# EAGLE design micromouse (EAGLE 9.6.2)
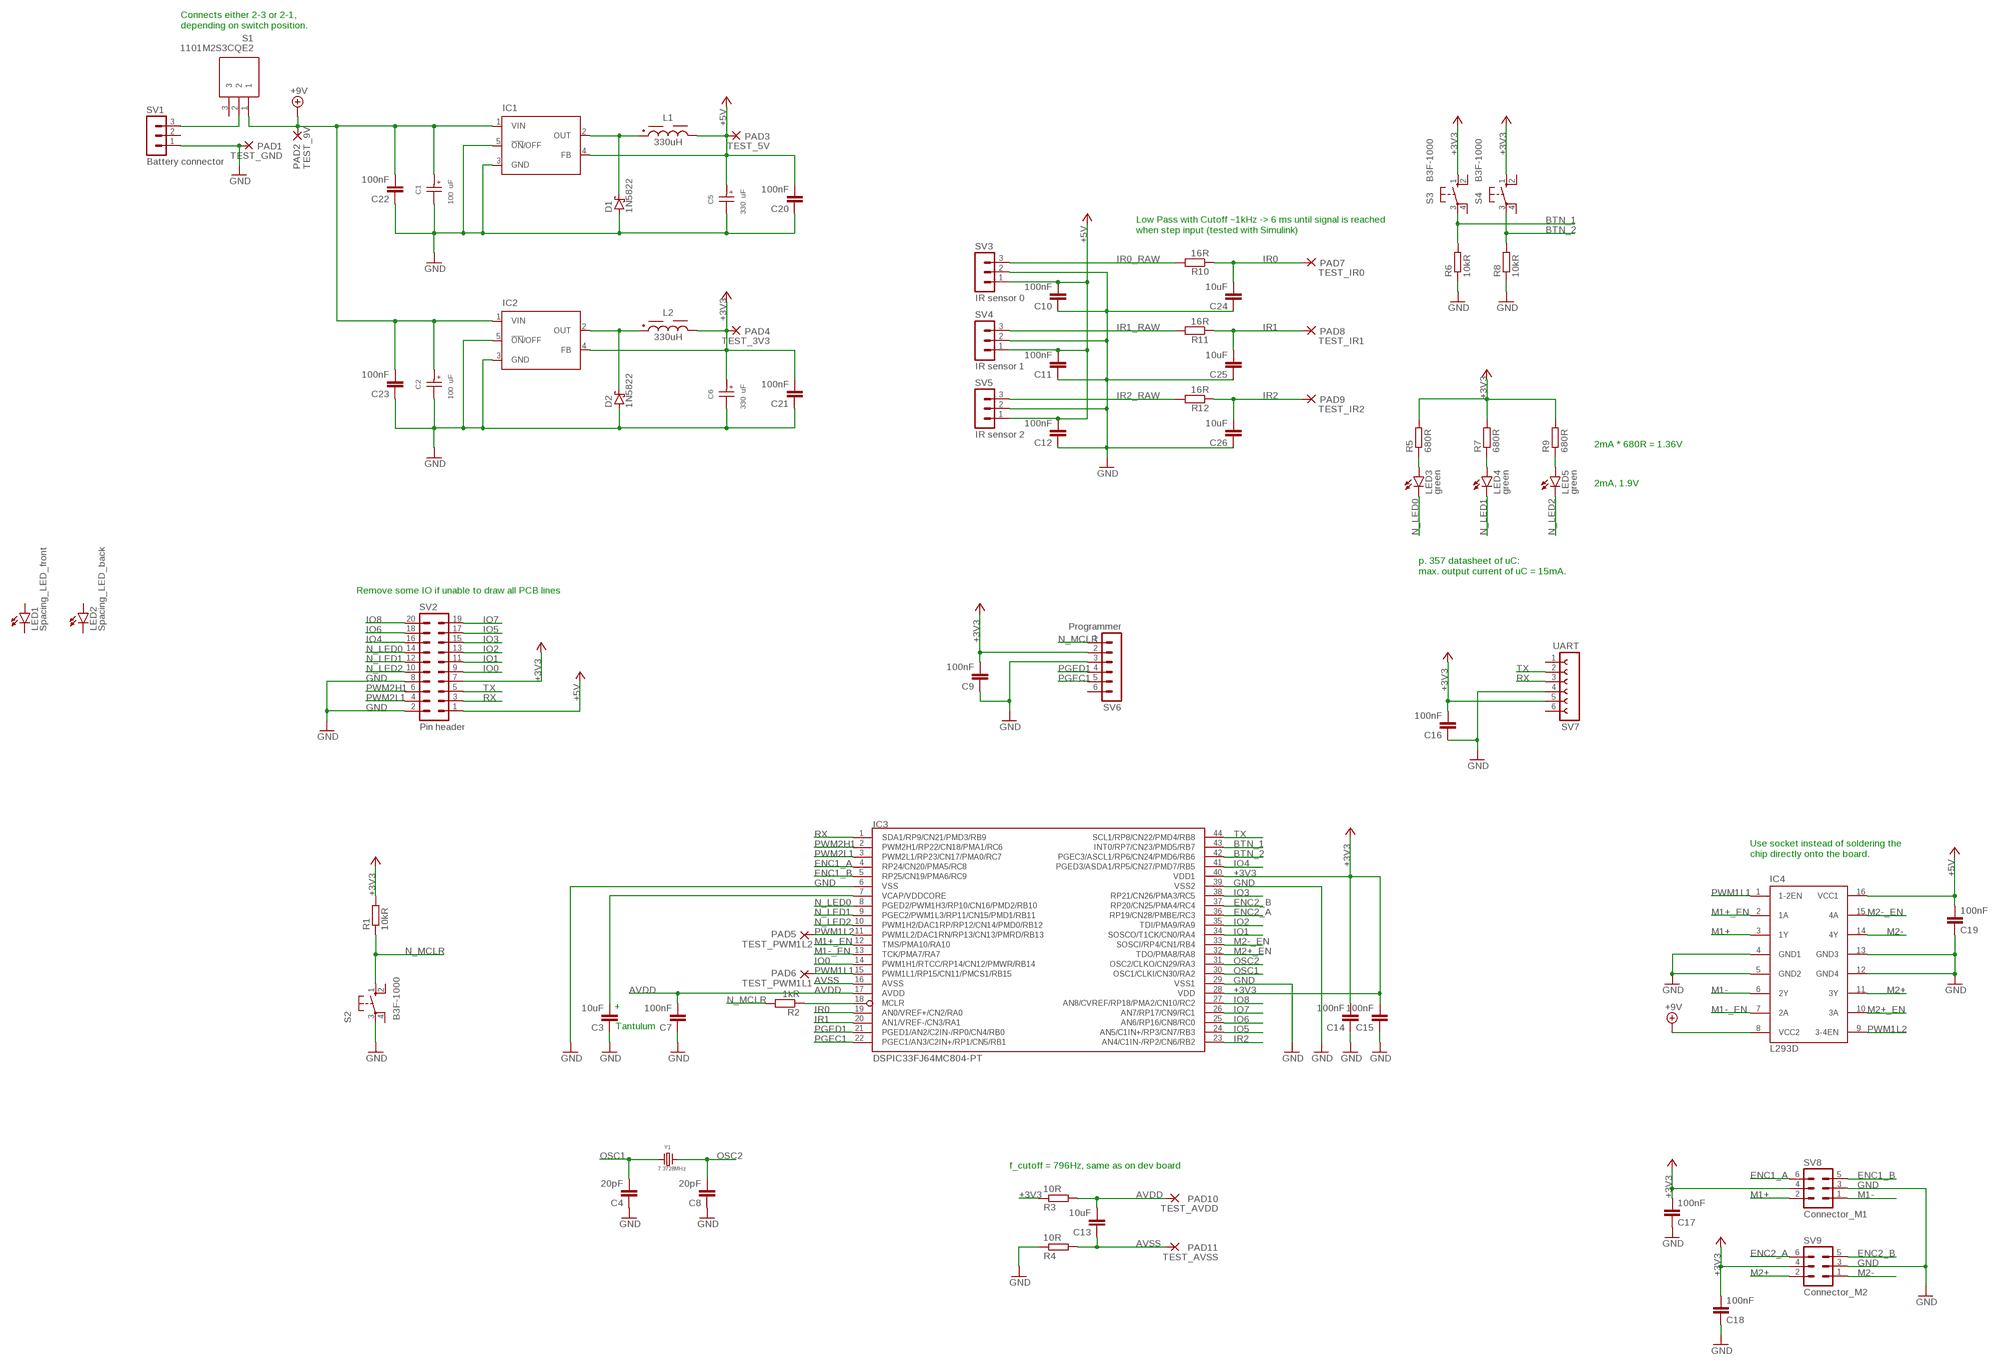
[diagram p0: schematic, sheet 1]

## Parts
C1  100 uF  WCAP-ATG5_5X11_860020272005  [WCAP-ATG5_5X11(DXL)]
C2  100 uF  WCAP-ATG5_5X11_860020272005  [WCAP-ATG5_5X11(DXL)]
C3  10uF  C-EUC0805  [C0805]
C4  20pF  C-EUC0805  [C0805]
C5  330 uF  WCAP-ATG5_6.3X11_860020273010  [WCAP-ATG5_6.3X11(DXL)]
C6  330 uF  WCAP-ATG5_6.3X11_860020273010  [WCAP-ATG5_6.3X11(DXL)]
C7  100nF  C-EUC0805  [C0805]
C8  20pF  C-EUC0805  [C0805]
C9  100nF  C-EUC0805  [C0805]
C10  100nF  C-EUC0805  [C0805]
C11  100nF  C-EUC0805  [C0805]
C12  100nF  C-EUC0805  [C0805]
C13  10uF  C-EUC0805  [C0805]
C14  100nF  C-EUC0805  [C0805]
C15  100nF  C-EUC0805  [C0805]
C16  100nF  C-EUC0805  [C0805]
C17  100nF  C-EUC0805  [C0805]
C18  100nF  C-EUC0805  [C0805]
C19  100nF  C-EUC0805  [C0805]
C20  100nF  C-EUC0805  [C0805]
C21  100nF  C-EUC0805  [C0805]
C22  100nF  C-EUC0805  [C0805]
C23  100nF  C-EUC0805  [C0805]
C24  10uF  C-EUC0805  [C0805]
C25  10uF  C-EUC0805  [C0805]
C26  10uF  C-EUC0805  [C0805]
D1  1N5822  BAT19  [DO35-10]
D2  1N5822  BAT19  [DO35-10]
IC1  LM2575-5.0WU-(TR)  LM2596S  [TO263-5]
IC2  LM2575-3.3WU-(TR)  LM2596S  [TO263-5]
IC3  DSPIC33FJ64MC804-PT  [TQFP44]
IC4  L293D  [DIL16]
L1  330uH  WE-TIS_1111_7447471331  [WE-TIS_1111]
L2  330uH  WE-TIS_1111_7447471331  [WE-TIS_1111]
LED1  Spacing_LED_front  LED5MM  [LED5MM]
LED2  Spacing_LED_back  LED5MM  [LED5MM]
LED3  green  LEDCHIP-LED0805  [CHIP-LED0805]
LED4  green  LEDCHIP-LED0805  [CHIP-LED0805]
LED5  green  LEDCHIP-LED0805  [CHIP-LED0805]
PAD1  TEST_GND  3,17/1,3  [3,17/1,3]
PAD2  TEST_9V  3,17/1,3  [3,17/1,3]
PAD3  TEST_5V  3,17/1,3  [3,17/1,3]
PAD4  TEST_3V3  3,17/1,3  [3,17/1,3]
PAD5  TEST_PWM1L2  3,17/1,3  [3,17/1,3]
PAD6  TEST_PWM1L1  3,17/1,3  [3,17/1,3]
PAD7  TEST_IR0  3,17/1,3  [3,17/1,3]
PAD8  TEST_IR1  3,17/1,3  [3,17/1,3]
PAD9  TEST_IR2  3,17/1,3  [3,17/1,3]
PAD10  TEST_AVDD  3,17/1,3  [3,17/1,3]
PAD11  TEST_AVSS  3,17/1,3  [3,17/1,3]
R1  10kR  R-EU_R0805  [R0805]
R2  1kR  R-EU_R0805  [R0805]
R3  10R  R-EU_R0805  [R0805]
R4  10R  R-EU_R0805  [R0805]
R5  680R  R-EU_R0805  [R0805]
R6  10kR  R-EU_R0805  [R0805]
R7  680R  R-EU_R0805  [R0805]
R8  10kR  R-EU_R0805  [R0805]
R9  680R  R-EU_R0805  [R0805]
R10  16R  R-EU_R0805  [R0805]
R11  16R  R-EU_R0805  [R0805]
R12  16R  R-EU_R0805  [R0805]
S1  1101M2S3CQE2  [1000-SERIES(SPDT)]
S2  B3F-1000  10-XX  [B3F-10XX]
S3  B3F-1000  10-XX  [B3F-10XX]
S4  B3F-1000  10-XX  [B3F-10XX]
SV1  Battery connector  MA03-1  [MA03-1]
SV2  Pin header  MA10-2  [MA10-2]
SV3  IR sensor 0  MA03-1  [MA03-1]
SV4  IR sensor 1  MA03-1  [MA03-1]
SV5  IR sensor 2  MA03-1  [MA03-1]
SV6  Programmer  MA06-1  [MA06-1]
SV7  UART  FE06-1  [FE06]
SV8  Connector_M1  ML6  [ML6]
SV9  Connector_M2  ML6  [ML6]
Y1  7.3728MHz  WE-XTAL_HC49/4H_830003335B  [WE-XTAL_HC49/4H]

## Nets
+3V3: C6.1(+) C9.2 C14.2 C15.2 C16.2 C17.2 C18.2 C21.2 IC2.4(FB) IC3.28(VDD) IC3.40(VDD1) L2.2 PAD4.1(P) R1.2 R3.1 R5.2 R7.2 R9.2 S3.1(S) S4.1(S) SV2.7 SV6.2 SV7.5 SV8.4 SV9.4
+5V: C5.1(+) C10.2 C11.2 C12.2 C19.2 C20.2 IC1.4(FB) IC4.16(VCC1) L1.2 PAD3.1(P) SV2.1 SV3.1 SV4.1 SV5.1
+9V: C1.1(+) C2.1(+) C22.2 C23.2 IC1.1(VIN) IC2.1(VIN) IC4.8(VCC2) PAD2.1(P) S1.1
AVDD: C7.2 C13.2 IC3.17(AVDD) PAD10.1(P) R3.2
AVSS: C13.1 IC3.16(AVSS) PAD11.1(P) R4.2
BTN_1: IC3.43(INT0/RP7/CN23/PMD5/RB7) R6.2 S3.3(P)
BTN_2: IC3.42(PGEC3/ASCL1/RP6/CN24/PMD6/RB6) R8.2 S4.3(P)
ENC1_A: IC3.4(RP24/CN20/PMA5/RC8) SV8.6
ENC1_B: IC3.5(RP25/CN19/PMA6/RC9) SV8.5
ENC2_A: IC3.36(RP19/CN28/PMBE/RC3) SV9.6
ENC2_B: IC3.37(RP20/CN25/PMA4/RC4) SV9.5
GND: C1.2(-) C2.2(-) C3.1 C4.1 C5.2(-) C6.2(-) C7.1 C8.1 C9.1 C10.1 C11.1 C12.1 C14.1 C15.1 C16.1 C17.1 C18.1 C19.1 C20.1 C21.1 C22.1 C23.1 C24.1 C25.1 C26.1 D1.A D2.A IC1.3(GND) IC1.5(!ON!/OFF) IC2.3(GND) IC2.5(!ON!/OFF) IC3.6(VSS) IC3.29(VSS1) IC3.39(VSS2) IC4.4(GND1) IC4.5(GND2) IC4.12(GND4) IC4.13(GND3) PAD1.1(P) R4.1 R6.1 R8.1 S2.3(P) SV1.1 SV2.2 SV2.8 SV3.2 SV4.2 SV5.2 SV6.3 SV7.4 SV8.3 SV9.3
IO0: IC3.14(PWM1H1/RTCC/RP14/CN12/PMWR/RB14) SV2.9
IO1: IC3.34(SOSCO/T1CK/CN0/RA4) SV2.11
IO2: IC3.35(TDI/PMA9/RA9) SV2.13
IO3: IC3.38(RP21/CN26/PMA3/RC5) SV2.15
IO4: IC3.41(PGED3/ASDA1/RP5/CN27/PMD7/RB5) SV2.16
IO5: IC3.24(AN5/C1IN+/RP3/CN7/RB3) SV2.17
IO6: IC3.25(AN6/RP16/CN8/RC0) SV2.18
IO7: IC3.26(AN7/RP17/CN9/RC1) SV2.19
IO8: IC3.27(AN8/CVREF/RP18/PMA2/CN10/RC2) SV2.20
IR0: C24.2 IC3.19(AN0/VREF+/CN2/RA0) PAD7.1(P) R10.1
IR0_RAW: R10.2 SV3.3
IR1: C25.2 IC3.20(AN1/VREF-/CN3/RA1) PAD8.1(P) R11.1
IR1_RAW: R11.2 SV4.3
IR2: C26.2 IC3.23(AN4/C1IN-/RP2/CN6/RB2) PAD9.1(P) R12.1
IR2_RAW: R12.2 SV5.3
M1+: IC4.3(1Y) SV8.2
M1+_EN: IC3.12(TMS/PMA10/RA10) IC4.2(1A)
M1-: IC4.6(2Y) SV8.1
M1-_EN: IC3.13(TCK/PMA7/RA7) IC4.7(2A)
M2+: IC4.11(3Y) SV9.2
M2+_EN: IC3.32(TDO/PMA8/RA8) IC4.10(3A)
M2-: IC4.14(4Y) SV9.1
M2-_EN: IC3.33(SOSCI/RP4/CN1/RB4) IC4.15(4A)
N$1: IC3.18(MCLR) R2.1
N$2: S1.2 SV1.3
N$4: LED3.A R5.1
N$5: LED4.A R7.1
N$6: LED5.A R9.1
N$7: D1.C IC1.2(OUT) L1.1
N$8: D2.C IC2.2(OUT) L2.1
N_LED0: IC3.8(PGED2/PWM1H3/RP10/CN16/PMD2/RB10) LED3.C SV2.14
N_LED1: IC3.9(PGEC2/PWM1L3/RP11/CN15/PMD1/RB11) LED4.C SV2.12
N_LED2: IC3.10(PWM1H2/DAC1RP/RP12/CN14/PMD0/RB12) LED5.C SV2.10
N_MCLR: R1.1 R2.2 S2.1(S) SV6.1
OSC1: C4.2 IC3.30(OSC1/CLKI/CN30/RA2) Y1.1
OSC2: C8.2 IC3.31(OSC2/CLKO/CN29/RA3) Y1.2
PGEC1: IC3.22(PGEC1/AN3/C2IN+/RP1/CN5/RB1) SV6.5
PGED1: IC3.21(PGED1/AN2/C2IN-/RP0/CN4/RB0) SV6.4
PWM1L1: IC3.15(PWM1L1/RP15/CN11/PMCS1/RB15) IC4.1(1-2EN) PAD6.1(P)
PWM1L2: IC3.11(PWM1L2/DAC1RN/RP13/CN13/PMRD/RB13) IC4.9(3-4EN) PAD5.1(P)
PWM2H1: IC3.2(PWM2H1/RP22/CN18/PMA1/RC6) SV2.6
PWM2L1: IC3.3(PWM2L1/RP23/CN17/PMA0/RC7) SV2.4
RX: IC3.1(SDA1/RP9/CN21/PMD3/RB9) SV2.3 SV7.3
TX: IC3.44(SCL1/RP8/CN22/PMD4/RB8) SV2.5 SV7.2
VCAP/VDDCORE: C3.2 IC3.7(VCAP/VDDCORE)
Unconnected: LED1.A LED1.K(C) LED2.A LED2.K(C) S1.3 S2.2(S1) S2.4(P1) S3.2(S1) S3.4(P1) S4.2(S1) S4.4(P1) SV1.2 SV6.6 SV7.1 SV7.6

## Notes on the sheet
- Connects either 2-3 or 2-1,
  depending on switch position.
- Low Pass with Cutoff ~1kHz -> 6 ms until signal is reached
  when step input (tested with Simulink)
- 2mA * 680R = 1.36V
- 2mA, 1.9V
- p. 357 datasheet of uC:
  max. output current of uC = 15mA.
- Remove some IO if unable to draw all PCB lines
- Use socket instead of soldering the
  chip directly onto the board.
- +
- Tantulum
- f_cutoff = 796Hz, same as on dev board

## Library data of the parts
C1 C2 = Eagle_WCAP-ATG5 (rev21a):WCAP-ATG5_5X11: WCAP-ATG5 Aluminium Electrolytic Capacitors General Purpose +105 °C Characteristics General purpose product series with max. operating temperature of +105 °C Mounting style: THT Radial Capacitance range: 0.1 µF ‒ 18000 µF Capacitance tolerance: ±20 % Operating temperature: -40 °C up to +105 °C for UR < 400 V(DC) -25 °C up to +105 °C for UR ≥ 400 V(DC) Endurance: 2000 h @ +105 °C Dimensions (DxL) in mm: 5.0 x 11.0 up to 22.0 x 31.0 Recommended soldering: Wave soldering Applications Filtering Smoothing Energy storage Coupling e.g. Switched-mode power supply, AC/DC converter, adapter, charger, digital camera <https://www.we-online.com/catalog/media/o35284v209%20WCAP-ATG5_4C.jpg> Details see: https://www.we-online.com/catalog/en/WCAP-ATG5/ Updated by yingchun,Shan;2020-02-28 2020(C) Würth Elektronik; DATASHEET-URL: https://www.we-online.com/catalog/datasheet/860020272005.pdf; DF: 17%; DIAMETER: 5mm; I-LEAK: 10uA; I-RIPPLE: 105mA; L: 11mm; OPERATING-TEMPERATURE: -40 °C up to +105 °C; PART-NUMBER: 860020272005; PITCH: 2mm; TECHNICAL-REFERENCE: ATDC110101M010DSPA3B000; VR: 10V(DC)
C3 C4 C7-C26 = rcl:C-EU: CAPACITOR, European symbol; SPICEPREFIX: C
C5 C6 = Eagle_WCAP-ATG5 (rev21a):WCAP-ATG5_6.3X11: WCAP-ATG5 Aluminium Electrolytic Capacitors General Purpose +105 °C Characteristics General purpose product series with max. operating temperature of +105 °C Mounting style: THT Radial Capacitance range: 0.1 µF ‒ 18000 µF Capacitance tolerance: ±20 % Operating temperature: -40 °C up to +105 °C for UR < 400 V(DC) -25 °C up to +105 °C for UR ≥ 400 V(DC) Endurance: 2000 h @ +105 °C Dimensions (DxL) in mm: 5.0 x 11.0 up to 22.0 x 31.0 Recommended soldering: Wave soldering Applications Filtering Smoothing Energy storage Coupling e.g. Switched-mode power supply, AC/DC converter, adapter, charger, digital camera <https://www.we-online.com/catalog/media/o35284v209%20WCAP-ATG5_4C.jpg> Details see: https://www.we-online.com/catalog/en/WCAP-ATG5/ Updated by yingchun,Shan;2020-02-28 2020(C) Würth Elektronik; DATASHEET-URL: https://www.we-online.com/catalog/datasheet/860020273010.pdf; DF: 17%; DIAMETER: 6.3mm; I-LEAK: 33uA; I-RIPPLE: 205mA; L: 11mm; OPERATING-TEMPERATURE: -40 °C up to +105 °C; PART-NUMBER: 860020273010; PITCH: 2.5mm; TECHNICAL-REFERENCE: ATDD110331M010DSPA4B000; VR: 10V(DC)
D1 D2 = diode:BAT19: DIODE barrier diode
IC1 IC2 = national-semiconductor:LM2596: SIMPLE SWITCHER® Power Converter 150 kHz 3A Step-Down Voltage Regulator Source: http://www.national.com/ds/LM/LM2596.pdf; MF: NATIONAL SEMICONDUCTOR; MPN: LM2596S-ADJ/NOPB; OC_FARNELL: 9494367; OC_NEWARK: 41K3842
IC3 = microchip-dspic33fjxxmc:DSPIC33FJ64MC804: dsPIC33FJ32MC302/304, dsPIC33FJ64MCX02/X04, AND dsPIC33FJ128MCX02/X04 High-Performance, 16-bit Digital Signal Controllers Package:44 Pin TQFP Operating Range: * Up to 40 MIPS operation (at 3.0V -3.6V): - Industrial temperature range (-40°C to +85°C) - Extended temperature range (-40°C to +125°C) High-Performance DSC CPU: * Modified Harvard architecture * C compiler optimized instruction set * 16-bit wide data path * 24-bit wide instructions * Linear program memory addressing up to 4M instruction words * Linear data memory addressing up to 64 Kbytes * 83 base instructions: mostly 1 word/1 cycle * Two 40-bit accumulators with rounding and saturation options * Flexible and powerful addressing modes: - Indirect - Modulo - Bit-Reversed * Software stack * 16 x 16 fractional/integer multiply operations * 32/16 and 16/16 divide operations * Single-cycle multiply and accumulate: - Accumulator write back for DSP operations - Dual data fetch * Up to ±16-bit shifts for up to 40-bit data Direct Memory Access (DMA): * 8-channel hardware DMA * Up to 2 Kbytes dual ported DMA buffer area (DMA RAM) to store data transferred via DMA: - Allows data transfer between RAM and a peripheral while CPU is executing code (no cycle stealing) * Most peripherals support DMA Timers/Capture/Compare/PWM: * Timer/Counters, up to five 16-bit timers: - Can pair up to make two 32-bit timers - One timer runs as a Real-Time Clock with an external 32.768 kHz oscillator - Programmable prescaler * Input Capture (up to four channels): - Capture on up, down or both edges - 16-bit capture input functions - 4-deep FIFO on each capture * Output Compare (up to four channels): - Single or Dual 16-bit Compare mode - 16-bit Glitchless PWM mode * Hardware Real-Time Clock/Calendar (RTCC): - Provides clock, calendar, and alarm functions Interrupt Controller: * 5-cycle latency * Up to 53 available interrupt sources * Up to three external interrupts * Seven programmable priority levels * Five processor exceptions Digital I/O: * Peripheral pin Select functionality * Up to 35 programmable digital I/O pins * Wake-up/Interrupt-on-Change for up to 31 pins * Output pins can drive from 3.0V to 3.6V * Up to 5V output with open drain configuration * All digital input pins are 5V tolerant * 4 mA sink on all I/O pins On-Chip Flash and SRAM: * Flash program memory (up to 128 Kbytes) * Data SRAM (up to 16 Kbytes) * Boot, Secure, and General Security for program Flash System Management: * Flexible clock options: - External, crystal, resonator, internal RC - Fully integrated Phase-Locked Loop (PLL) - Extremely low jitter PLL * Power-up Timer * Oscillator Start-up Timer/Stabilizer * Watchdog Timer with its own RC oscillator * Fail-Safe Clock Monitor * Reset by multiple sources Power Management: * On-chip 2.5V voltage regulator * Switch between clock sources in real time * Idle, Sleep, and Doze modes with fast wake-up Analog-to-Digital Converters (ADCs): * 10-bit, 1.1 Msps or 12-bit, 500 Ksps conversion: - Two and four simultaneous samples (10-bit ADC) - Up to nine input channels with auto-scanning - Conversion start can be manual or synchronized with one of four trigger sources - Conversion possible in Sleep mode - ±2 LSb max integral nonlinearity - ±1 LSb max differential nonlinearity Audio Digital-to-Analog Converter (DAC): - 16-bit Dual Channel DAC module - 100 Ksps maximum sampling rate - Second-Order Digital Delta-Sigma Modulator Comparator Module: * Two analog comparators with programmable input/output configuration CMOS Flash Technology: * Low-power, high-speed Flash technology * Fully static design * 3.3V (±10%) operating voltage * Industrial and Extended temperature * Low power consumption Motor Control Peripherals: * 6-channel 16-bit Motor Control PWM: - Three duty cycle generators - Independent or Complementary mode - Programmable dead-time and output polarity - Edge-aligned or center-aligned - Manual output override control - One Fault input - Trigger for ADC conversions - PWM frequency for 16-bit resolution (@ 40 MIPS) = 1220 Hz for Edge-Aligned mode, 610 Hz for Center-Aligned mode - PWM frequency for 11-bit resolution (@ 40 MIPS) = 39.1 kHz for Edge-Aligned mode, 19.55 kHz for Center-Aligned mode * 2-channel 16-bit Motor Control PWM: - One duty cycle generator - Independent or Complementary mode - Programmable dead time and output polarity - Edge-aligned or center-aligned - Manual output override control - One Fault input - Trigger for ADC conversions - PWM frequency for 16-bit resolution (@ 40 MIPS) = 1220 Hz for Edge-Aligned mode, 610 Hz for Center-Aligned mode - PWM frequency for 11-bit resolution (@ 40 MIPS) = 39.1 kHz for Edge-Aligned mode, 19.55 kHz for Center-Aligned mode * 2-Quadrature Encoder Interface module: - Phase A, Phase B, and index pulse input - 16-bit up/down position counter - Count direction status - Position Measurement (x2 and x4) mode - Programmable digital noise filters on inputs - Alternate 16-bit Timer/Counter mode - Interrupt on position counter rollover/underflow
IC4 = st-microelectronics:L293D: PUSH-PULL 4 CHANNEL DRIVER; MPN: L293D; OC_FARNELL: 9589619; OC_NEWARK: 56P8249
L1 L2 = Eagle_WE-TIS (rev22a):WE-TIS_1111: WE-TIS Radial Leaded Wire Wound Inductor Shielded Characteristics Radial through-hole inductor High saturation core material High current capacity Custom design on request Applications Signal filtering Switches, switching power supply for small and medium voltage Power supply filter EMI filter <https://www.we-online.com/catalog/media/o14867v209%20Family_WE-TIS.jpg> Details see: www.we-online.com/catalog/WE-TIS <www.we-online.com/catalog/WE-TIS/?utm_source=eagle_model&utm_medium=description_link&utm_campaign=eisos_eagle> Updated by Ella Wu, 2022-06-16 2022 (C) Wurth Elektronik; DATASHEET-URL: https://www.we-online.com/redexpert/spec/7447471331?ae; FRES: 2.1MHz; IR: 0.8A; ISAT: 1.1A; MOUNT: THT; PART-NUMBER: 7447471331; RDC-MAX: 810mohm; RDC-TYP: 670mohm
LED1-LED5 = led:LED: LED OSRAM: - CHIPLED LG R971, LG N971, LY N971, LG Q971, LY Q971, LO R971, LY R971 LH N974, LH R974 LS Q976, LO Q976, LY Q976 LO Q996 - Hyper CHIPLED LW Q18S LB Q993, LB Q99A, LB R99A - SideLED LS A670, LO A670, LY A670, LG A670, LP A670 LB A673, LV A673, LT A673, LW A673 LH A674 LY A675 LS A676, LA A676, LO A676, LY A676, LW A676 LS A679, LY A679, LG A679 - Hyper Micro SIDELED® LS Y876, LA Y876, LO Y876, LY Y876 LT Y87S - SmartLED LW L88C, LW L88S LB L89C, LB L89S, LG L890 LS L89K, LO L89K, LY L89K LS L896, LA L896, LO L896, LY L896 - TOPLED LS T670, LO T670, LY T670, LG T670, LP T670 LSG T670, LSP T670, LSY T670, LOP T670, LYG T670 LG T671, LOG T671, LSG T671 LB T673, LV T673, LT T673, LW T673 LH T674 LS T676, LA T676, LO T676, LY T676, LB T676, LH T676, LSB T676, LW T676 LB T67C, LV T67C, LT T67C, LS T67K, LO T67K, LY T67K, LW E67C LS E67B, LA E67B, LO E67B, LY E67B, LB E67C, LV E67C, LT E67C LW T67C LS T679, LY T679, LG T679 LS T770, LO T770, LY T770, LG T770, LP T770 LB T773, LV T773, LT T773, LW T773 LH T774 LS E675, LA E675, LY E675, LS T675 LS T776, LA T776, LO T776, LY T776, LB T776 LHGB T686 LT T68C, LB T68C - Hyper Mini TOPLED® LB M676 - Mini TOPLED Santana® LG M470 LS M47K, LO M47K, LY M47K Source: http://www.osram.convergy.de LUXEON: - LUMILED® LXK2-PW12-R00, LXK2-PW12-S00, LXK2-PW14-U00, LXK2-PW14-V00 LXK2-PM12-R00, LXK2-PM12-S00, LXK2-PM14-U00 LXK2-PE12-Q00, LXK2-PE12-R00, LXK2-PE12-S00, LXK2-PE14-T00, LXK2-PE14-U00 LXK2-PB12-K00, LXK2-PB12-L00, LXK2-PB12-M00, LXK2-PB14-N00, LXK2-PB14-P00, LXK2-PB14-Q00 LXK2-PR12-L00, LXK2-PR12-M00, LXK2-PR14-Q00, LXK2-PR14-R00 LXK2-PD12-Q00, LXK2-PD12-R00, LXK2-PD12-S00 LXK2-PH12-R00, LXK2-PH12-S00 LXK2-PL12-P00, LXK2-PL12-Q00, LXK2-PL12-R00 Source: www.luxeon.com KINGBRIGHT: KA-3528ASYC Source: www.kingbright.com
PAD1-PAD11 = wirepad:3,17/1,3: THROUGH-HOLE PAD
R1-R12 = rcl:R-EU_: RESISTOR, European symbol; SPICEPREFIX: R
S1 = SamacSys_Parts:1101M2S3CQE2: 1101M2S3CQE2 (Slide Switches) Source: Datasheet <https://www.ckswitches.com/media/1429/1000.pdf>; DESCRIPTION: 1101M2S3CQE2 (Slide Switches); HEIGHT: mm; MANUFACTURER_NAME: C & K COMPONENTS; MANUFACTURER_PART_NUMBER: 1101M2S3CQE2; MOUSER_PART_NUMBER: 611-1101M2S3CQE2; MOUSER_PRICE-STOCK: https://www.mouser.co.uk/ProductDetail/CK/1101M2S3CQE2?qs=C4UUOezh8MStnZqkTHGAfQ%3D%3D
S2-S4 = switch-omron:10-XX: OMRON SWITCH; MPN: B3F-1000; OC_FARNELL: 176432; OC_NEWARK: 36M3542
SV1 SV3-SV5 = con-lstb:MA03-1: PIN HEADER; OC_FARNELL: unknown; OC_NEWARK: unknown
SV2 = con-lstb:MA10-2: PIN HEADER; OC_FARNELL: unknown; OC_NEWARK: unknown
SV6 = con-lstb:MA06-1: PIN HEADER; OC_FARNELL: unknown; OC_NEWARK: unknown
SV7 = con-lsta:FE06-1: FEMALE HEADER; OC_FARNELL: unknown; OC_NEWARK: unknown
SV8 SV9 = con-ml:ML6: HARTING; OC_FARNELL: unknown; OC_NEWARK: unknown
Y1 = Eagle_WE-XTAL (rev21c):WE-XTAL_HC49/4H: WE-XTAL Quartz Crystal Characteristics SMT and THT models Hermetically sealed Frequencies between 1.8432 MHz and 50 MHz Tolerances down to ±10 ppm available Maximum operating temperatures range: -40 °C to 85 °C Stabilities down to ±10 ppm available Applications Microprocessor Wireless Communication Devices Industrial Devices Wired Communication (e.g. Ethernet and USB) IoT Optical Network Audio and Multimedia Devices Test and Measurement Equipment Navigation and Locators Wearables <https://www.we-online.com/catalog/media/o135919v209%20Family_WE-XTAL_IQXC-42.jpg> Details see: https://www.we-online.com/catalog/en/WE-XTAL Updated by Ella Wu , 2019-09-03 2019 (C) Wurth Elektronik; C-LOAD: 30pF; DATASHEET-URL: https://www.we-online.com/catalog/datasheet/830003335B.pdf; MOUNT: THT; PART-NUMBER: 830003335B; STABILITY: 50ppm; TOLERANCE: ±30ppm

## Board
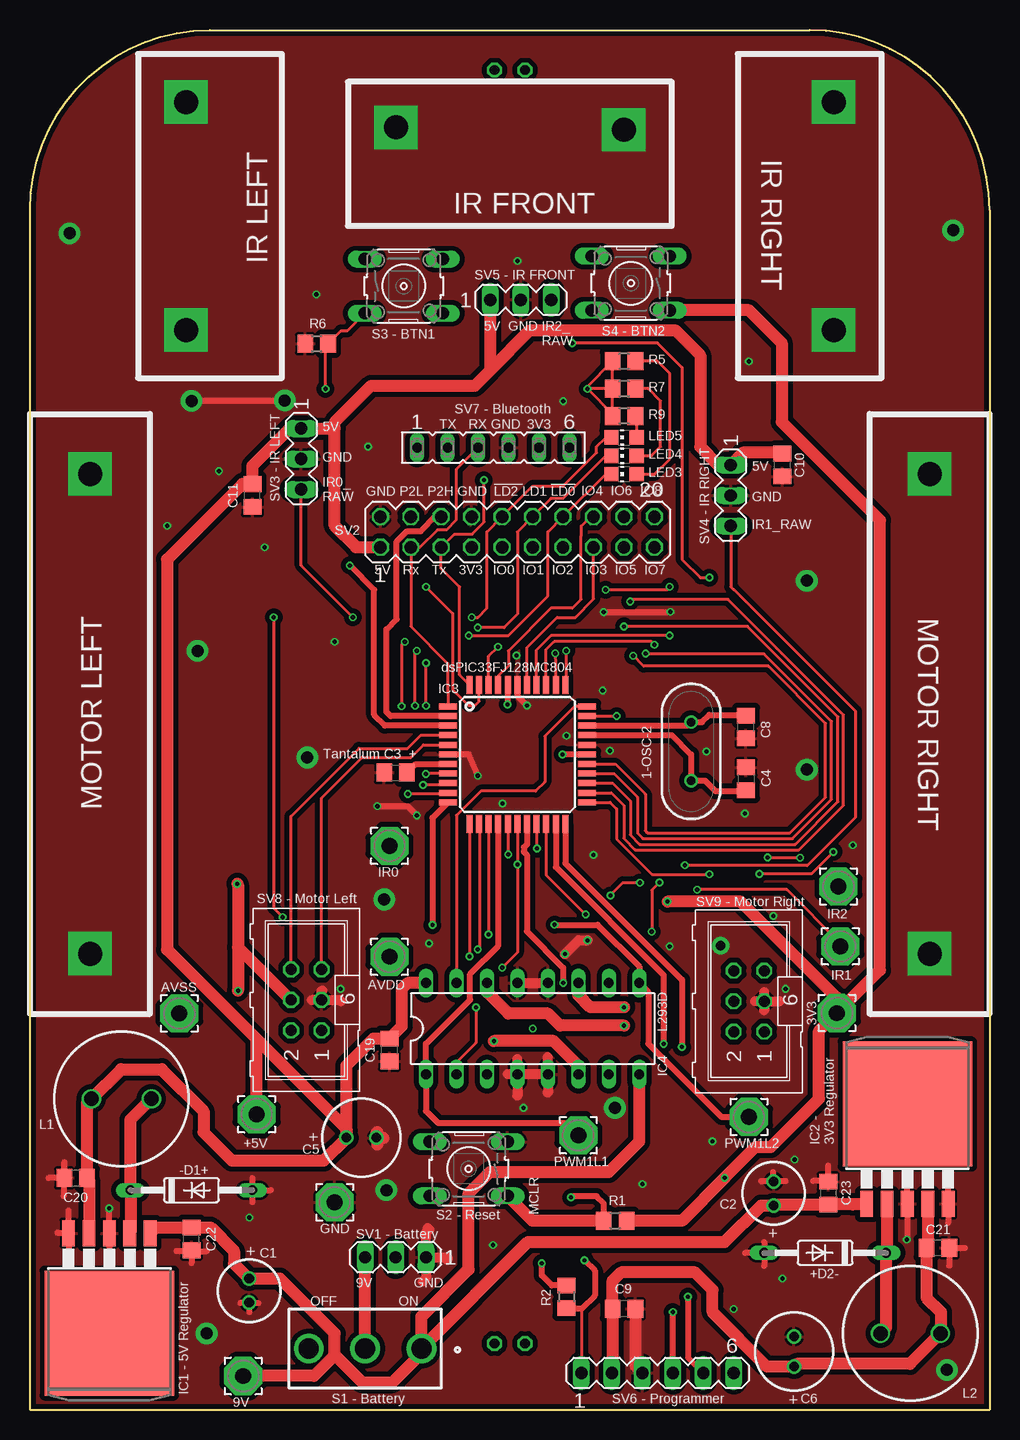
[diagram p1: board, top side]
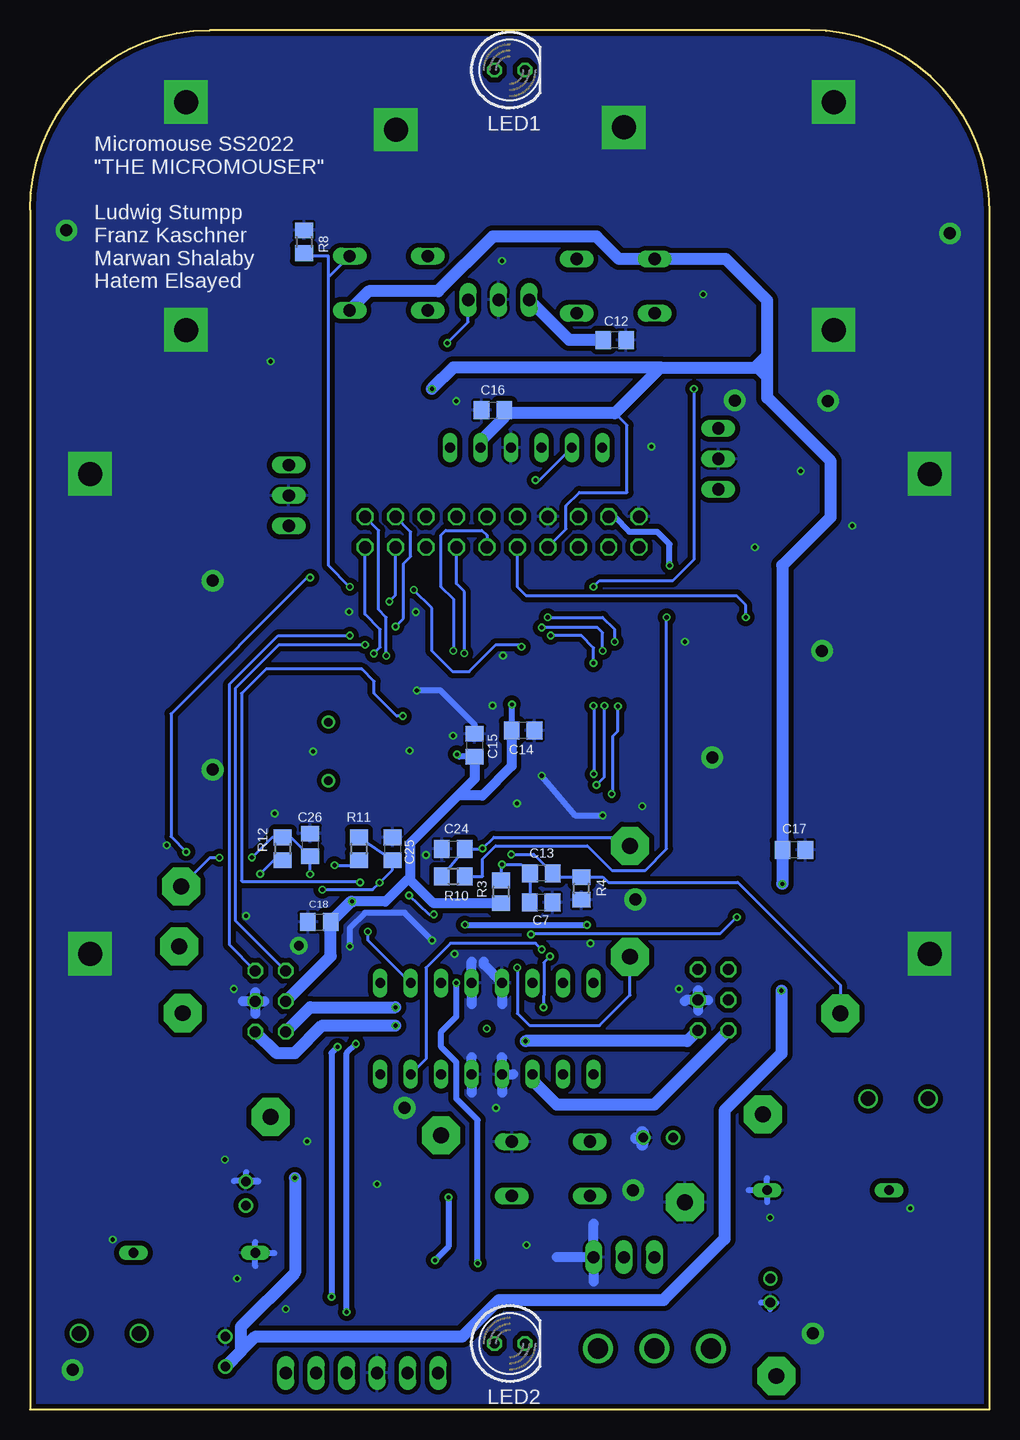
[diagram p2: board, bottom side, seen from below]

Size 80 x 115 mm. Coordinates in mm from the lower left corner, seen from the top.
Outline: 15,115 65,115 arc-90 80,100 80,0 0,0 0,100 arc-90 15,115
Copper layers (1*16): Top 0.035mm / dielectric 1.5mm / Bottom 0.035mm
Design rules "PCB-POOL Standard": minimum track width 0.15mm, minimum drill 0.3mm, track to track 0.15mm, track to pad 0.15mm, pad to pad 0.15mm, via to via 0.15mm, smd to smd 0.15mm, copper to edge 0.3mm, drill to drill 0.2mm, minimum pad ring 0.2mm, minimum via ring 0.15mm, stop-mask expansion 0.03mm, vias tented up to drill 0mil, thermal gap 0.2mm

### Footprints (pad centres in the part's own frame; a part is rotated, then mirrored left to right if it is on the bottom)
WCAP-ATG5_5X11(DXL) = drill 0.8: 1 1,0; 2 -1,0
C0805 = smd 1.3 x 1.5: 1 -0.95,0; 2 0.95,0
WCAP-ATG5_6.3X11(DXL) = drill 0.8: 1 1.25,0; 2 -1.25,0
DO35-10 = drill 0.813 long: A 5.08,0; C -5.08,0
TO263-5 = smd 1.067 x 2.159: 1 -3.404,-5.791; 2 -1.702,-5.791; 3 0,-5.791; 4 1.702,-5.791; 5 3.404,-5.791 | smd 10.8 x 10.41: 6 0,2.54
TQFP44 = smd 1.5 x 0.5: 1 -5.8,4; 2 -5.8,3.2; 3 -5.8,2.4; 4 -5.8,1.6; 5 -5.8,0.8; 6 -5.8,0; 7 -5.8,-0.8; 8 -5.8,-1.6; 9 -5.8,-2.4; 10 -5.8,-3.2; 11 -5.8,-4; 23 5.8,-4; 24 5.8,-3.2; 25 5.8,-2.4; 26 5.8,-1.6; 27 5.8,-0.8; 28 5.8,0; 29 5.8,0.8; 30 5.8,1.6; 31 5.8,2.4; 32 5.8,3.2; 33 5.8,4 | smd 0.5 x 1.5: 12 -4,-5.8; 13 -3.2,-5.8; 14 -2.4,-5.8; 15 -1.6,-5.8; 16 -0.8,-5.8; 17 0,-5.8; 18 0.8,-5.8; 19 1.6,-5.8; 20 2.4,-5.8; 21 3.2,-5.8; 22 4,-5.8; 34 4,5.8; 35 3.2,5.8; 36 2.4,5.8; 37 1.6,5.8; 38 0.8,5.8; 39 0,5.8; 40 -0.8,5.8; 41 -1.6,5.8; 42 -2.4,5.8; 43 -3.2,5.8; 44 -4,5.8
DIL16 = drill 0.813 long: 1 -8.89,-3.81; 2 -6.35,-3.81; 3 -3.81,-3.81; 4 -1.27,-3.81; 5 1.27,-3.81; 6 3.81,-3.81; 7 6.35,-3.81; 8 8.89,-3.81; 9 8.89,3.81; 10 6.35,3.81; 11 3.81,3.81; 12 1.27,3.81; 13 -1.27,3.81; 14 -3.81,3.81; 15 -6.35,3.81; 16 -8.89,3.81
WE-TIS_1111 = drill 1.2: 1 -2.5,0; 2 2.5,0
LED5MM = drill 0.813 octagon: A -1.27,0; K 1.27,0
CHIP-LED0805 = smd 1.2 x 1.2: A 0,-1.05; C 0,1.05
3,17/1,3 = drill 1.321 pad 3.175 octagon: 1 0,0
R0805 = smd 1.3 x 1.5: 1 -0.95,0; 2 0.95,0
1000-SERIES(SPDT) = drill 1.68 pad 2.48: 1 0,-4.7; 2 0,0; 3 0,4.7
B3F-10XX = drill 1.016 long: 1 -3.251,2.261; 2 3.251,2.261; 3 -3.251,-2.261; 4 3.251,-2.261
MA03-1 = drill 1.016 long: 1 -2.54,0; 2 0,0; 3 2.54,0
MA10-2 = drill 1.016 octagon: 1 -11.43,-1.27; 2 -11.43,1.27; 3 -8.89,-1.27; 4 -8.89,1.27; 5 -6.35,-1.27; 6 -6.35,1.27; 7 -3.81,-1.27; 8 -3.81,1.27; 9 -1.27,-1.27; 10 -1.27,1.27; 11 1.27,-1.27; 12 1.27,1.27; 13 3.81,-1.27; 14 3.81,1.27; 15 6.35,-1.27; 16 6.35,1.27; 17 8.89,-1.27; 18 8.89,1.27; 19 11.43,-1.27; 20 11.43,1.27
MA06-1 = drill 1.016 long: 1 -6.35,0; 2 -3.81,0; 3 -1.27,0; 4 1.27,0; 5 3.81,0; 6 6.35,0
FE06 = drill 0.813 long: 1 -6.35,0; 2 -3.81,0; 3 -1.27,0; 4 1.27,0; 5 3.81,0; 6 6.35,0
ML6 = drill 0.914 octagon: 1 -2.54,-1.27; 2 -2.54,1.27; 3 0,-1.27; 4 0,1.27; 5 2.54,-1.27; 6 2.54,1.27
WE-XTAL_HC49/4H = drill 0.7: 1 -2.44,0; 2 2.44,0

### Placement (x,y rotation side)
C1  18.27,9.91 90 top
C2  62,18.01 270 top
C3  30.48,53.09 0 top
C4  59.69,52.58 270 top
C5  27.64,22.66 180 top
C6  63.7,4.83 270 top
C7  37.39,42.27 180 bottom
C8  59.69,56.9 90 top
C9  49.53,8.38 180 top
C10  62.74,78.74 90 top
C11  18.54,76.2 90 top
C12  31.24,89.15 180 bottom
C13  37.36,44.7 180 bottom
C14  38.89,56.62 180 bottom
C15  42.93,55.37 270 bottom
C16  41.4,83.31 0 bottom
C17  16.31,46.66 180 bottom
C18  55.88,40.64 0 bottom
C19  29.97,29.97 90 top
C20  3.81,19.3 0 top
C21  75.69,13.46 180 top
C22  13.46,14.22 90 top
C23  66.55,18.03 270 top
C24  44.7,46.74 0 bottom
C25  49.78,46.74 270 bottom
C26  56.64,47.07 270 bottom
D1  13.46,18.29 0 top
D2  66.29,13.06 180 top
IC1  6.62,8.91 180 top
IC2  73.15,22.93 0 top
IC3  40.64,54.61 0 top
IC4  41.91,31.75 0 top
L1  7.62,25.91 180 top
L2  73.41,6.35 0 top
LED1  40,111.66 0 bottom
LED2  40,5.5 0 bottom
LED3  49.53,77.98 90 top
LED4  49.53,79.5 90 top
LED5  49.53,81.03 90 top
PAD1  25.4,17.27 0 top
PAD2  17.78,2.79 0 top
PAD3  18.9,24.61 0 top
PAD4  67.28,33.05 0 top
PAD5  59.94,24.38 0 top
PAD6  45.72,22.86 0 top
PAD7  29.97,46.99 0 top
PAD8  67.56,38.61 0 top
PAD9  67.41,43.59 0 top
PAD10  29.97,37.74 0 top
PAD11  12.45,33.02 0 top
R1  48.79,15.75 0 top
R2  44.72,9.4 270 top
R3  40.72,43.15 90 bottom
R4  34.01,43.43 90 bottom
R5  49.53,87.38 180 top
R6  23.9,88.85 0 top
R7  49.53,85.09 180 top
R8  57.15,97.35 270 bottom
R9  49.53,82.8 180 top
R10  44.7,44.45 0 bottom
R11  52.58,46.74 270 bottom
R12  58.93,46.74 270 bottom
S1  27.94,5.08 90 top
S2  36.58,20.07 180 top
S3  31.17,93.65 0 top
S4  50.09,93.89 180 top
SV1  30.48,12.7 180 top
SV2  40.64,73.15 0 top
SV3  22.61,79.25 270 top
SV4  58.42,76.2 270 top
SV5  40.92,92.51 0 top
SV6  52.32,3.05 0 top
SV7  38.63,80.19 0 top
SV8  23.04,34.14 90 top
SV9  59.94,34.04 90 top
Y1  55.12,54.86 90 top

### Tracks (layer width: path | path; a pad name or v marks a point on that pad's centre or on a via)
+3V3  (via drill 0.35)
  Top 0.254: R7.2 v46.48,85.09 | R7.2 R9.2 48.58,82.99 v46.48,85.09 | R7.2 R5.2 46.48,85.28 v46.48,85.09
  Top 0.508: IC3.40 39.82,60.39 v39.82,58.78 | IC3.28 v44.4,54.61
  Top 1.016: SV6.2 48.58,3.11 C9.2 48.58,10.73 49.28,11.43 55.44,11.43 56.9,9.97 56.9,8.13 61.45,3.58 C6.1 63.94,3.81 73.37,3.81 L2.2 75.95,6.39 75.95,8.13 74.74,9.33 C21.2 74.85,13.57 IC2.4 | R1.2 54.36,15.75 v57.91,19.3 60.49,21.88 61.76,21.88 65.79,25.91 65.79,31.55 PAD4.1 | S4.1 59.95,91.63 62.68,88.9 62.68,82.32 70.87,74.13 70.87,36.63 PAD4.1 | SV8.4 21.74,34.14 17.35,38.53 | v17.27,43.81 17.35,43.74 17.35,38.53 | v53.15,42.35 59.25,42.35 67.28,34.31 PAD4.1 | 17.35,38.53 v17.35,34.92
  Bottom 0.254: SV2.7 35.31,73.41 35.31,75.35 34.2,76.45 30.23,76.45 30.23,82.04 31.24,83.06
  Bottom 0.508: C15.2 44.21,54.42 v44.4,54.61 | v39.82,58.78 39.84,58.76 C14.2
  Bottom 0.813: C15.2 42.93,52.58 44.32,51.18 | 44.32,51.18 48.26,47.24 48.26,44.12 | R3.1 46.34,42.2 48.26,44.12 | v53.15,42.35 50.36,42.35 48.59,44.12 48.26,44.12 | C14.2 39.84,53.63 42.29,51.18 44.32,51.18
  Bottom 1.016: v46.48,85.09 44.7,86.87 27.43,86.87 | 18.53,86.11 18.53,84.34 13.25,79.06 13.25,74.38 17.27,70.36 17.27,46.67 C17.2 17.26,43.83 v17.27,43.81 | 18.53,86.11 18.53,86.61 | 18.53,86.61 18.53,87.88 | 18.53,87.88 18.53,92.44 22,95.91 S3.1 30.89,95.91 32.77,97.79 41.4,97.79 45.97,93.22 51.75,93.22 S4.1 | 27.43,86.87 19.3,86.87 | 19.3,86.87 18.78,86.87 18.53,86.61 | v53.15,42.35 53.22,42.35 C18.2 54.93,37.78 SV9.4 | v57.91,19.3 57.91,11.4 62.43,6.88 62.43,4.85 C6.1 61.18,6.1 43.94,6.1 40.89,9.14 27.18,9.14 22.1,14.22 22.1,24.92 17.35,29.67 v17.35,34.92 | 27.43,86.87 31.24,83.06 40.2,83.06 C16.2 40.45,82.74 42.44,80.75 SV7.5 | 18.53,87.88 19.3,87.11 19.3,86.87 | 19.3,86.87 18.54,86.11 18.53,86.11
+5V
  Top 1.016: 38.38,86.64 37.08,85.34 28.45,85.34 25.4,82.3 25.4,81.79 | 38.38,86.64 41.71,89.97 53.8,89.97 55.88,87.88 55.88,80.26 57.4,78.74 SV4.1 59.44,79.76 62.67,79.76 C10.2 | IC4.16 31.5,35.56 30.99,35.05 30.99,31.94 C19.2 28.64,30.92 26.39,28.67 C5.1 | 38.38,86.64 SV5.1 | 25.4,81.79 25.4,73.66 27.18,71.88 SV2.1 | 25.4,81.79 SV3.1 21.66,81.79 18.54,78.67 C11.2 17.71,77.15 11.43,70.87 11.43,38.35 18.9,30.89 | C5.1 24.49,20.76 16.83,20.76 14.48,23.11 14.48,24.89 11,28.37 7.58,28.37 L1.2 4.76,25.55 C20.2 4.92,19.15 IC1.4 | C5.1 26.39,23.4 18.9,30.89 | PAD3.1 18.9,30.89
  Bottom 1.016: SV5.1 35.03,89.15 C12.2
+9V
  Top 1.016: 25.4,4.52 23.67,2.79 PAD2.1 | 25.4,4.52 25.4,6.35 20.84,10.91 C1.1 17.02,12.16 17.02,13.21 15.05,15.17 C22.2 10.5,15.17 IC1.1 | 25.4,4.52 25.45,4.52 27.69,2.29 30.23,2.29 32.64,4.7 S1.1 | IC4.8 50.8,22.35 48.26,19.81 38.35,19.81 36.58,18.03 36.58,11.68 32.64,7.75 S1.1 | S1.1 41.53,13.97 57.91,13.97 60.96,17.02 C2.1 62.08,17.08 C23.2 68.58,17.08 69.7,17.08 IC2.1
AVDD  (via drill 0.35)
  Top 0.254: v39.37,36.83 40.64,38.1 v40.64,45.42 IC3.17
  Bottom 0.254: R3.2 40.72,45.35 v40.64,45.42 39.03,45.42 C13.2 38.31,42.29 C7.2 | v39.37,36.83 39.37,33.02 38.35,32 32.51,32 29.97,34.54 PAD10.1
AVSS  (via drill 0.35)
  Top 0.254: IC3.16 39.84,46.32 v39.88,46.28
  Bottom 0.254: v39.88,46.28 37.99,46.28 C13.1 36.09,44.38 R4.2 32.23,44.38 31.79,43.94 20.98,43.94 12.45,35.41 PAD11.1
BTN_1  (via drill 0.35)
  Top 0.254: IC3.43 37.44,59.03 37.08,58.67 36.58,58.67 35.23,60.02 35.23,66.37 v33.02,68.58 | S3.3 26.44,89.92 25.91,89.92 R6.2 24.64,88.64 v24.64,85.09
  Bottom 0.254: v33.02,68.58 32.51,69.09 26.42,69.09 24.64,70.87 v24.64,85.09
BTN_2  (via drill 0.35)
  Top 0.254: v53.34,68.58 53.09,68.33 v48.01,68.33 | IC3.42 38.24,62.8 v39.01,63.58
  Bottom 0.254: v48.01,68.33 46.48,66.8 46.48,63.25 44.76,61.52 43.38,61.52 41.15,63.75 39.19,63.75 v39.01,63.58 | v53.34,68.58 55.12,70.36 55.12,94.38 | S4.3 55.12,94.38 | 55.12,94.38 55.12,96.15 56.91,96.15 R8.2
ENC1_A
  Top 0.254: SV8.6 21.77,49.45 27.43,55.12 31.5,55.12 32.59,56.21 IC3.4
ENC1_B
  Top 0.254: SV8.5 24.31,50.98 27.69,54.36 31.75,54.36 32.8,55.41 IC3.5
ENC2_A  (via drill 0.35)
  Top 0.254: IC3.36 43.04,63.36 43.69,64.01 51.82,64.01 v52.07,63.75
  Bottom 0.254: v52.07,63.75 59.24,63.75 62.89,60.11 62.89,40.79 SV9.6
ENC2_B  (via drill 0.35)
  Top 0.254: IC3.37 42.24,63.32 43.43,64.52 v53.34,64.52
  Bottom 0.254: v53.34,64.52 59.31,64.52 63.39,60.43 63.39,38.76 SV9.5
GND  (via drill 0.35, 0.8, 1, 2)
  Top 0.508: v41.43,58.7 40.64,59.49 IC3.39 | v37.34,52.83 36.58,54.61 IC3.6 | v21.23,84.12 21.18,84.07 v13.46,84.07 | v28.96,50.29 31.5,50.29 v32.26,49.53 | v47.83,66.47 53.37,66.47 v53.39,66.5 | IC1.3 6.62,12.97 6.6,12.95 | IC1.5 3.22,13.12 3.05,12.95 | IC1.5 2.32,14.7 2.29,14.73 | 18.29,8.13 18.29,8.89 19.05,8.89 | 18.26,8.89 17.53,8.89 | D2.A 61.21,11.94 | 61.21,13.97 D2.A | 77.98,13.46 C21.1 76.64,12 76.66,11.99 | 66.55,20.32 C23.1 66.48,19.05 65.28,19.05 | 18.54,17.27 D1.A | D1.A 18.54,19.3 | D1.A 20.07,18.29 | C20.1 1.52,19.3 | C20.1 2.86,20.61 2.87,20.62 2.87,19.31 C20.1 | C20.1 2.79,19.24 2.79,17.78 | C22.1 13.46,12.19 | C22.1 13.53,13.21 14.73,13.21 | C22.1 13.4,13.21 12.19,13.21 | D2.A 59.61,13.06 | C2.2 61,19.01 60.96,19.05 | C2.2 61.98,19.03 61.98,19.81 | C2.2 62.04,19.05 62.99,19.05 | 73.15,18.8 IC2.3 73.15,14.22 v73.1,14.17 | 76.53,18.69 76.56,18.67 IC2.5 76.56,15.54 | IC1.5 3.22,16.58 3.23,16.59 | 6.6,14.71 v6.6,16.76
  Top 0.813: SV1.1 33.02,14.73 33.27,14.99 33.15,15.11 | SV1.1 34.8,12.7 34.8,12.45 | SV1.1 33.02,10.92 32.77,10.67 | IC4.5 IC4.4 | IC4.5 43.18,26.42 | IC4.4 40.64,26.16 | IC4.4 40.64,29.21 | IC4.4 39.85,27.94 39.83,27.96 | SV9.3 62.48,34.04 | SV9.3 61.21,34.8 | SV9.3 60.45,34.04 | SV9.3 61.21,33.27 | SV8.3 25.81,34.14 25.91,34.04 | SV8.3 24.31,34.87 24.36,34.92 | SV8.3 23.52,34.14 | IC4.13 IC4.12 | IC4.5 43.18,29.39 | v44.6,37.97 45.74,39.12 v46.48,39.12
  Top 1.016: C9.1 50.48,3.62 SV6.3 | IC1.3 6.6,14.71 | 18.29,8.89 C1.2 18.26,8.89 | C5.2 28.89,23.04 28.96,23.11 | C5.2 29.41,22.66 29.46,22.61 | C5.2 28.96,22.59 28.96,22.1
  Bottom 0.508: v37.34,52.83 34.54,49.53 v32.26,49.53 | C15.1 42.93,57.08 45.79,59.94 v47.75,59.94 | C1.2 19.03,8.91 | 18.29,8.89 18.29,8.38 | 18.26,8.89 17.78,8.89 | v46.48,39.12 48.77,41.4 52.07,41.4 53.34,40.13 v53.34,38.61 | 61.21,11.94 D2.A | D2.A 61.21,13.97 | D1.A 18.54,19.3 | D1.A 18.54,17.27 | D1.A 20.07,18.29 | D2.A 59.64,13.06 | C2.2 61,19.01 60.96,19.05 61.96,19.05 C2.2 | C2.2 61.98,19.03 61.98,19.81 | C2.2 62.04,19.05 62.99,19.05
  Bottom 0.813: SV1.1 33.02,15.49 | SV1.1 33.02,10.67 | SV1.1 36.07,12.7 | 43.18,29.39 IC4.5 43.18,26.42 | IC4.4 40.64,29.34 40.66,29.36 | IC4.4 39.73,27.94 | IC4.4 40.64,26.42 | SV9.3 61.21,34.8 | SV9.3 62.23,34.04 | SV9.3 61.21,33.02 | SV9.3 60.45,34.04 | SV8.3 25.3,34.14 25.4,34.04 | SV8.3 24.31,34.98 | SV8.3 23.47,34.14 | SV8.3 24.31,33.25 | 40.64,33.78 IC4.13 42.16,37.08 42.16,37.34 | 43.18,33.78 IC4.12 43.18,37.34
  Bottom 1.016: 18.29,8.89 C1.2 18.26,8.89 | C5.2 28.96,22.59 28.96,22.1 | C5.2 28.94,22.61 29.46,22.61 | C5.2 28.89,23.04 28.96,23.11
  other vias: 44.73,56.16 29.72,18.29 48.77,25.15 23.11,54.36 64.77,53.34 3.3,98.04 76.96,98.3 76.45,3.3 14.73,6.35 29.54,42.52 5,78 5,38 75,38 75,78 13,109 13,90 67,109 67,90 49.5,106.68 30.5,106.88 57.58,38.66 64.77,69.09 13.97,63.25 59.61,49.68 56.39,54.86 48.36,54.91 33.27,38.86 25.91,35.05 25.4,64.01 40.64,95.76 40.56,62.87 19.56,71.88 11.43,73.66 15.75,78.23 41.15,25.15 63.75,20.83 62.74,10.92 51.05,18.8 56.9,22.35 18.29,16 38.61,13.72 62.99,35.05 68.61,47.04 59.94,87.38 58.67,8.38 46.99,46.23 39.4,50.52 61.98,41.15 28.19,80.26 23.88,92.96 44.45,84.07
  pour Top (isolate 0.406): 0,0 0,115 80,115 80,0
  pour Bottom (isolate 0.406): 0,0 80,0 80,115 0,115
IO0  (via drill 0.35)
  Top 0.254: v20.32,66.04 20.32,41.8 v21.07,41.05 | IC3.14 v38.24,39.61 v38.23,39.6
  Bottom 0.254: v38.23,39.6 38.15,39.68 22.44,39.68 v21.07,41.05 | v20.32,66.04 20.32,67.06 21.08,67.82 38.61,67.82 39.37,68.58 SV2.9
IO1  (via drill 0.35)
  Top 0.254: IC3.34 44.7,60.47 v44.7,63.25
  Bottom 0.254: v44.7,63.25 44.7,67.56 45.72,68.58 45.72,72.9 45.34,73.28 42.31,73.28 41.91,72.88 SV2.11
IO2  (via drill 0.35)
  Top 0.254: IC3.35 43.84,62.38 v43.79,63.04
  Bottom 0.254: v43.79,63.04 43.79,68.17 44.45,68.83 SV2.13
IO3
  Top 0.254: IC3.38 41.44,63.54 43.94,66.04 45.47,66.04 46.99,67.56 SV2.15
IO4
  Top 0.254: SV2.16 46.74,74.42 45.97,73.66 45.97,72.85 45.95,72.82 45.95,67.54 45.21,66.8 43.43,66.8 39.88,63.25 39.88,61.98 39.04,61.14 IC3.41
IO5  (via drill 0.35)
  Top 0.254: IC3.24 48.47,51.41 49.51,50.37 49.51,47.61 50.46,46.66 64.12,46.66 67.82,50.36 67.82,57.91 58.19,67.54 50.22,67.54 v50.05,67.36
  Bottom 0.254: v50.05,67.36 49.53,67.88 SV2.17
IO6  (via drill 0.35)
  Top 0.254: IC3.25 48.58,52.21 50.04,50.75 50.04,47.9 50.82,47.12 63.81,47.12 67.36,50.67 67.36,57.74 59.82,65.28 v49.53,65.28
  Bottom 0.254: v49.53,65.28 48.87,65.94 48.87,70.51 48.26,71.12 48.26,73.15 SV2.18
IO7  (via drill 0.35)
  Top 0.254: IC3.26 48.69,53.01 50.65,51.05 50.65,48.04 51.09,47.6 63.57,47.6 66.83,50.86 66.83,57.37 61.2,62.99 51.34,62.99 v51.34,63.02
  Bottom 0.254: v51.34,63.02 50.8,63.55 50.8,65.02 52.07,66.29 SV2.19
IO8  (via drill 0.35)
  Top 0.254: IC3.27 48.81,53.81 51.31,51.31 51.31,48.26 51.49,48.08 63.37,48.08 66.32,51.03 66.32,57.2 61.54,61.98 51.16,61.98 v50.3,62.83
  Bottom 0.254: v50.3,62.83 v50.29,62.84 50.29,66.04 50.93,66.67 50.93,73.28 SV2.20
IR0  (via drill 0.35)
  Top 0.254: IC3.19 42.24,46.79 v42.27,46.76
  Bottom 0.254: R10.1 C24.2 42.29,46.74 v42.27,46.76 41.33,47.7 30.68,47.7 PAD7.1
IR0_RAW  (via drill 0.35)
  Top 0.254: v26.92,66.04 22.61,70.36 SV3.3
  Bottom 0.254: R10.2 42.27,44.45 42.27,45.91 41.19,46.99 33.53,46.99 31.5,44.96 28.7,44.96 26.92,46.74 v26.92,66.04
IR1  (via drill 0.35)
  Top 0.254: IC3.20 43.04,44.56 v46.33,41.27 | PAD8.1 67.56,38.86 63.09,43.34 v55.63,43.34 | v50.85,43.92 49.4,43.92 48.39,42.9 v48.39,42.85
  Bottom 0.254: v46.33,41.27 46.72,41.27 v48.39,42.85 | v55.63,43.34 51.43,43.34 v50.85,43.92 49.78,44.98 C25.2 R11.1
IR1_RAW  (via drill 0.35)
  Top 0.254: SV4.3 58.42,68.58 58.63,68.37 58.68,68.37 68.83,58.22 68.83,49.36 64.81,45.34 54.64,45.34 v54.61,45.37
  Bottom 0.254: v54.61,45.37 52.99,45.37 R11.2
IR2  (via drill 0.35)
  Top 0.254: IC3.23 48.36,50.61 48.91,50.06 48.91,47.56 51.85,44.62 v56.64,44.62 | v64.21,46 61.52,46 v61.49,46.02
  Bottom 0.254: v56.64,44.62 C26.2 58.21,47.69 R12.1 59.83,47.69 v61.49,46.02 | v64.21,46 65,46 PAD9.1
IR2_RAW  (via drill 0.35)
  Top 0.254: v45.21,88.9 52.32,88.9 54.36,86.87 54.36,70.87 55.88,69.34 v56.64,69.34 | v66.98,46.48 65.15,44.65 v60.81,44.65
  Bottom 0.254: v56.64,69.34 56.9,69.34 68.25,57.99 68.25,47.75 v66.98,46.48 | v60.81,44.65 59.67,45.79 R12.2 | v45.21,88.9 43.46,90.65 SV5.3
M1+
  Bottom 1.016: SV8.2 27.96,25.4 36.07,25.4 38.1,27.43 IC4.3
M1+_EN  (via drill 0.35)
  Top 0.254: IC3.12 36.64,37.78 v36.65,37.77 | v37.18,33.53 37.18,30.58 35.56,28.96 IC4.2
  Bottom 0.254: v37.18,33.53 37.18,34.49 37.16,34.51 37.16,37.26 v36.65,37.77
M1-  (via drill 0.35)
  Top 1.016: IC4.6 45.72,28.65 43.66,30.71 v38.68,30.71
  Bottom 1.016: SV8.1 25.2,30.71 v38.68,30.71
M1-_EN  (via drill 0.35)
  Top 0.254: IC3.13 37.47,48.78 37.47,38.48 v37.34,38.35
  Bottom 0.254: v37.34,38.35 37.85,38.86 44.96,38.86 46.99,36.83 46.99,29.21 IC4.7
M2+  (via drill 0.35)
  Top 1.016: v49.53,33.53 46.74,33.53 45.72,34.54 IC4.11
  Bottom 1.016: SV9.2 56.64,33.53 v49.53,33.53
M2+_EN  (via drill 0.35)
  Top 0.254: IC3.32 v48.92,57.81 | v52.48,43.94 51.84,43.31 v51.84,39.83
  Bottom 0.254: v51.84,39.83 v51.84,39.82 51.84,39.14 IC4.10 | v48.92,57.81 49.43,57.81 51.31,59.69 51.31,60.71 52.32,61.72 60.33,61.72 62.36,59.69 62.36,44.07 62.31,44.02 52.55,44.02 v52.48,43.94
M2-  (via drill 0.35)
  Top 1.016: v49.53,32 44.2,32 43.18,33.02 39.88,33.02 38.1,34.8 IC4.14
  Bottom 1.016: SV9.1 59.44,29.72 57.91,29.72 55.63,32 v49.53,32
M2-_EN
  Top 0.254: IC3.33 45.4,58.61 42.93,56.13 42.93,52.32 42.16,51.56 37.59,51.56 35.56,49.53 IC4.15
N$1  (via drill 0.35)
  Top 0.508: R2.1 43.5,10.35 42.67,11.18 v42.67,12.19 | IC3.18 41.44,47.12 41.17,46.85 41.17,46.48 41.42,46.23 41.42,39.85 44.45,36.83 v44.45,35.56
  Bottom 0.508: v42.67,12.19 42.67,24.13 44.45,25.91 44.45,28.96 45.72,30.23 45.72,31.5 44.45,32.77 v44.45,35.56
N$2
  Top 1.016: S1.2 SV1.3
N$4
  Top 0.254: LED3.A 52.07,77.98 53.34,79.25 53.34,86.36 52.32,87.38 R5.1
N$5
  Top 0.254: LED4.A 51.82,79.5 52.58,80.26 52.58,84.07 51.56,85.09 R7.1
N$6
  Top 0.254: R9.1 50.58,82.7 LED5.A
N$7
  Top 1.016: L1.1 8.38,24.17 D1.C 8.38,14.76 IC1.2
N$8
  Top 1.016: IC2.2 71.45,13.13 D2.C 71.37,6.82 L2.1
N$14  (via drill 0.35)
  other vias: 41.91,31.75
N_LED0  (via drill 0.35)
  Top 0.254: v33.02,58.67 v33.02,62.23 | v36.58,64.52 39.88,64.52 43.18,67.82 43.18,73.15 SV2.14 48.01,77.98 LED3.C | IC3.8 33.03,53.01 v33,52.98
  Bottom 0.254: v33.02,58.67 33,58.65 v33,52.98 | v33.02,62.23 33.02,63.5 34.04,64.52 v36.58,64.52
N_LED1  (via drill 0.35)
  Top 0.254: v32.11,58.67 32.11,63.1 v32.26,63.25 | LED4.C 48.01,79.5 44.45,75.95 43.43,75.95 SV2.12 40.64,73.15 40.64,66.29 39.52,65.18 v37.34,65.18 | IC3.9 34.7,52.07 v32.77,52.07
  Bottom 0.254: v32.26,63.25 32.26,64.77 32.67,65.18 v37.34,65.18 | v32.77,52.07 32.11,52.73 v32.11,58.67
N_LED2  (via drill 0.35)
  Top 0.254: v30.99,58.63 30.99,63.75 v31.24,64.01 | v36.83,66.04 37.34,66.04 38.1,66.8 38.1,73.15 SV2.10 41.91,76.96 44.45,76.96 47.24,79.76 47.24,80.26 48.01,81.03 LED5.C | IC3.10 34.74,51.31 v31.5,51.31
  Bottom 0.254: v30.99,58.63 30.99,56.56 31.39,56.15 31.39,51.41 v31.5,51.31 | v31.24,64.01 31.24,65.02 32.26,66.04 v36.83,66.04
N_MCLR  (via drill 0.35)
  Top 0.254: R2.2 44.72,8.38 | 45.97,8.38 SV6.1
  Top 0.508: v46.23,12.45 47.08,11.59 47.08,9.49 45.97,8.38 44.72,8.38 | R1.1 47.84,17.18 47.24,17.78 45.21,17.78 v45.11,17.68
  Top 1.016: R1.1 41.88,15.75 S2.1
  Bottom 0.508: v45.11,17.68 45.11,13.56 v46.23,12.45
OSC1
  Top 0.508: C4.2 59.62,51.56 57.15,51.56 56.29,52.42 Y1.1 55.12,54.61 53.52,56.21 IC3.30
OSC2
  Top 0.508: C8.2 59.62,57.91 56.64,57.91 56.03,57.3 Y1.2 54.82,57.01 IC3.31
PGEC1  (via drill 0.35)
  Top 0.508: IC3.22 44.64,45.53 54.36,35.81 v54.36,30.23 | v54.86,9.4 54.86,4.32 SV6.5
  Bottom 0.508: v54.36,30.23 54.86,29.72 v54.86,9.4
PGED1  (via drill 0.35)
  Top 0.508: IC3.21 43.84,45.21 52.83,36.22 v52.83,30.48 | SV6.4 v53.59,8.13
  Bottom 0.508: v53.59,8.13 53.59,29.72 v52.83,30.48
PWM1L1
  Top 0.508: IC3.15 39.02,48.78 39.02,38.62 36.7,36.31 36.7,34.16 33.02,30.48 IC4.1 33.02,24.89 34.04,23.88 44.7,23.88 PAD6.1
PWM1L2  (via drill 0.35)
  Top 0.508: IC3.11 33.55,49.32 v33.55,40.39 | v43.74,40.41 47.31,40.41 50.8,36.92 IC4.9 51.56,34.8 51.56,30.48 57.66,24.38 PAD5.1
  Bottom 0.508: v43.74,40.41 43.71,40.39 v33.55,40.39
PWM2H1
  Top 0.508: IC3.2 30.07,57.81 29.72,58.17 29.72,65.02 30.58,65.89 30.58,72.37 31.44,73.23 32.59,73.23 33.78,74.42 SV2.6
PWM2L1  (via drill 0.35)
  Top 0.508: IC3.3 29.6,57.01 28.7,57.91 28.7,68.33 v26.67,70.36
  Bottom 0.508: v26.67,70.36 26.67,72.14 27.69,73.16 30.03,73.16 31.29,74.42 SV2.4
RX
  Top 0.254: IC3.1 34.84,59.84 34.83,59.85 34.83,62.2 31.75,65.28 SV2.3 32.51,71.88 33.96,73.33 34.72,73.33 35.56,74.17 35.56,78.38 SV7.3
TX  (via drill 0.35)
  Top 0.254: IC3.44 35.81,61.24 35.81,68.58 34.29,70.1 SV2.5 35.38,72.97 36.85,72.97 37.87,73.99 37.87,77.44 v37.85,77.47
  Bottom 0.254: v37.85,77.47 37.54,77.47 SV7.2
VCAP/VDDCORE
  Top 0.508: C3.2 32.15,53.81 IC3.7

### Text on the board
tPlace: IR RIGHT | IR FRONT | IR LEFT | SV5 - IR FRONT | R6 | 5V | GND | S4 - BTN2 | S3 - BTN1 | IR2_ / RAW | R5 | R7 | SV7 - Bluetooth | TX | RX | GND | 3V3 | R9 | 5V | LED5 | C10 | GND | LED4 | LED3 | 5V | C11 | GND P2L P2H GND | !LD2 !LD1 !LD0 | SV3 - IR LEFT | IR0_ / RAW | IO4 IO6 IO8 | GND | SV2 | IR1_RAW | SV4 - IR RIGHT | 5V Rx Tx 3V3 | IO0 IO1 IO2 IO3 IO5 IO7 | MOTOR RIGHT | dsPIC33FJ128MC804 | IC3 | C8 | Tantalum | C3 | + | 1-OSC-2 | C4 | MOTOR LEFT | IR0 | SV8 - Motor Left | SV9 - Motor Right | IR2 | AVDD | IR1 | AVSS | IC4 L293D | 3V3 | C19 | L1 | +5V | PWM1L2 | C5 | IC2 - / 3V3 Regulator | PWM1L1 | -D1+ | C2 | C20 | R1 | C23 | S2 - Reset | MCLR | GND | C21 | SV1 - Battery | C22 | C1 | +D2- | 9V | GND | C9 | OFF | ON | R2 | L2 | IC1 - 5V Regulator | 9V | S1 - Battery | SV6 - Programmer | C6
bPlace: R8 | Micromouse SS2022 / "THE MICROMOUSER" / / Ludwig Stumpp / Franz Kaschner / Marwan Shalaby / Hatem Elsayed | C12 | C16 | C15 | C14 | R11 | C26 | C17 | C24 | C25 | C13 | R12 | R4 | R3 | R10 | C18 | C7
tDocu: Capacitor C3 for Pin VCAP has the following requirements: / "preferably surface mount connected within one-eights inch / of the VCAP pin connected to ground." / (see data sheet of microcontroller, p. 18)